# EAGLE design rgbled (EAGLE 6.5.0)
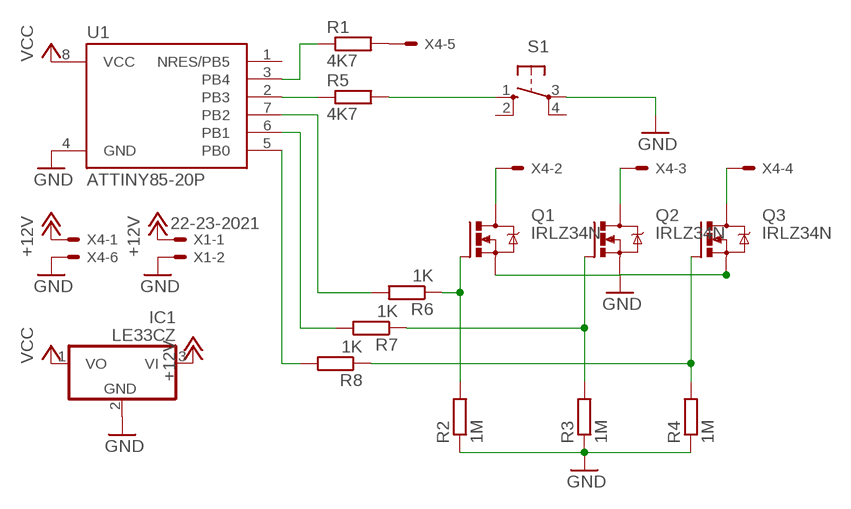
[diagram p0: schematic, sheet 1]

## Parts
IC1  LE33CZ  78L05Z  [TO92]
Q1  IRLZ34N  IRF540  [TO220BV]
Q2  IRLZ34N  IRF540  [TO220BV]
Q3  IRLZ34N  IRF540  [TO220BV]
R1  4K7  R-EU_0204/5  [0204/5]
R2  1M  R-EU_0204/5  [0204/5]
R3  1M  R-EU_0204/5  [0204/5]
R4  1M  R-EU_0204/5  [0204/5]
R5  4K7  R-EU_0204/5  [0204/5]
R6  1K  R-EU_0204/5  [0204/5]
R7  1K  R-EU_0204/5  [0204/5]
R8  1K  R-EU_0204/5  [0204/5]
S1  10-XX  [B3F-10XX]
U1  ATTINY85-20P  [PDIP08_300MIL]
X1  22-23-2021  [22-23-2021]
X4  22-23-2061  [22-23-2061]

## Nets
+12V: IC1.3(VI) X1.1 X4.1
GND: IC1.2(GND) Q1.S Q2.S Q3.S R2.1 R3.1 R4.1 S1.3(P) U1.4(GND) X1.2 X4.6
N$1: R5.2 S1.1(S)
N$2: Q1.D X4.2
N$3: Q2.D X4.3
N$4: Q3.D X4.4
N$5: R1.1 U1.3(PB4)
N$6: Q1.G R2.2 R6.1
N$8: Q2.G R3.2 R7.1
N$9: Q3.G R4.2 R8.1
N$10: R8.2 U1.5(PB0)
N$11: R7.2 U1.6(PB1)
N$12: R6.2 U1.7(PB2)
N$13: R1.2 X4.5
N$14: R5.1 U1.2(PB3)
VCC: IC1.1(VO) U1.8(VCC)
Unconnected: S1.2(S1) S1.4(P1) U1.1(NRES/PB5)

## Library data of the parts
IC1 = linear:78*: Positive VOLTAGE REGULATOR Source: http://cache.national.com/ds/LM/LM78L05.pdf http://www.fairchildsemi.com/ds/LM/LM7805.pdf
Q1-Q3 = transistor-power:IRF540: HEXFET Power MOSFET
R1-R8 = resistor:R-EU_: RESISTOR, European symbol
S1 = switch-omron:10-XX: OMRON SWITCH; MPN: B3F-1000; OC_FARNELL: 176432; OC_NEWARK: 36M3542
U1 = _hhn_attiny25_45_85:ATTINY85*: ATMEL ATtiny 85 Packages: P = PDIP 08 30mil S = SOIC 08 EIAJ 208mil Technologies Note: for complete ordering code (temp. range, finish, tape&reel etc.) see www.atmel.com • Supply Voltage: V = (1.8…5.5)V | [blank] = (2.7…5.5)V • Speed: 10 = 10 MHz | 20 = 20 MHz Author: Dipl.-Ing. FH Rainer Bayer HHN Hochschule Heilbronn (Heilbronn University), rainer.bayer@hs-heilbronn.de Ingenieurbüro ing-rb, mail@ing-rb.de
X1 = con-molex:22-23-2021: .100" (2.54mm) Center Header - 2 Pin; MF: MOLEX; MPN: 22-23-2021; OC_FARNELL: 1462926; OC_NEWARK: 25C3832
X4 = con-molex:22-23-2061: .100" (2.54mm) Center Header - 6 Pin; MF: MOLEX; MPN: 22-23-2061; OC_FARNELL: 1462922; OC_NEWARK: 27C1933

## Board
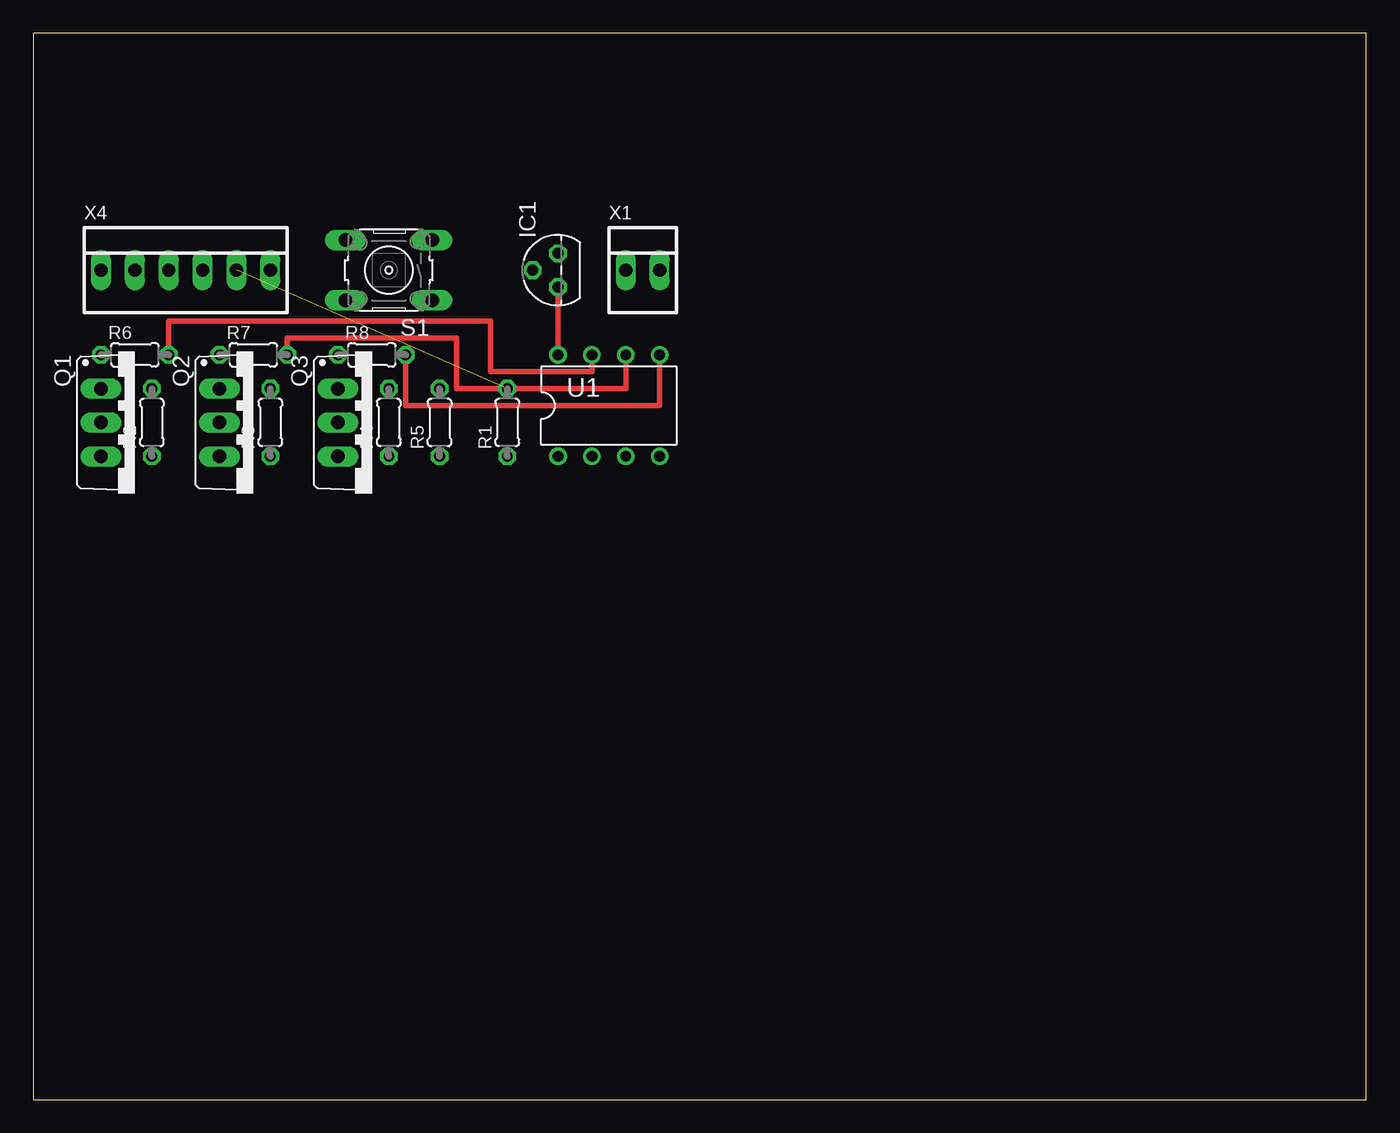
[diagram p1: board, top side]
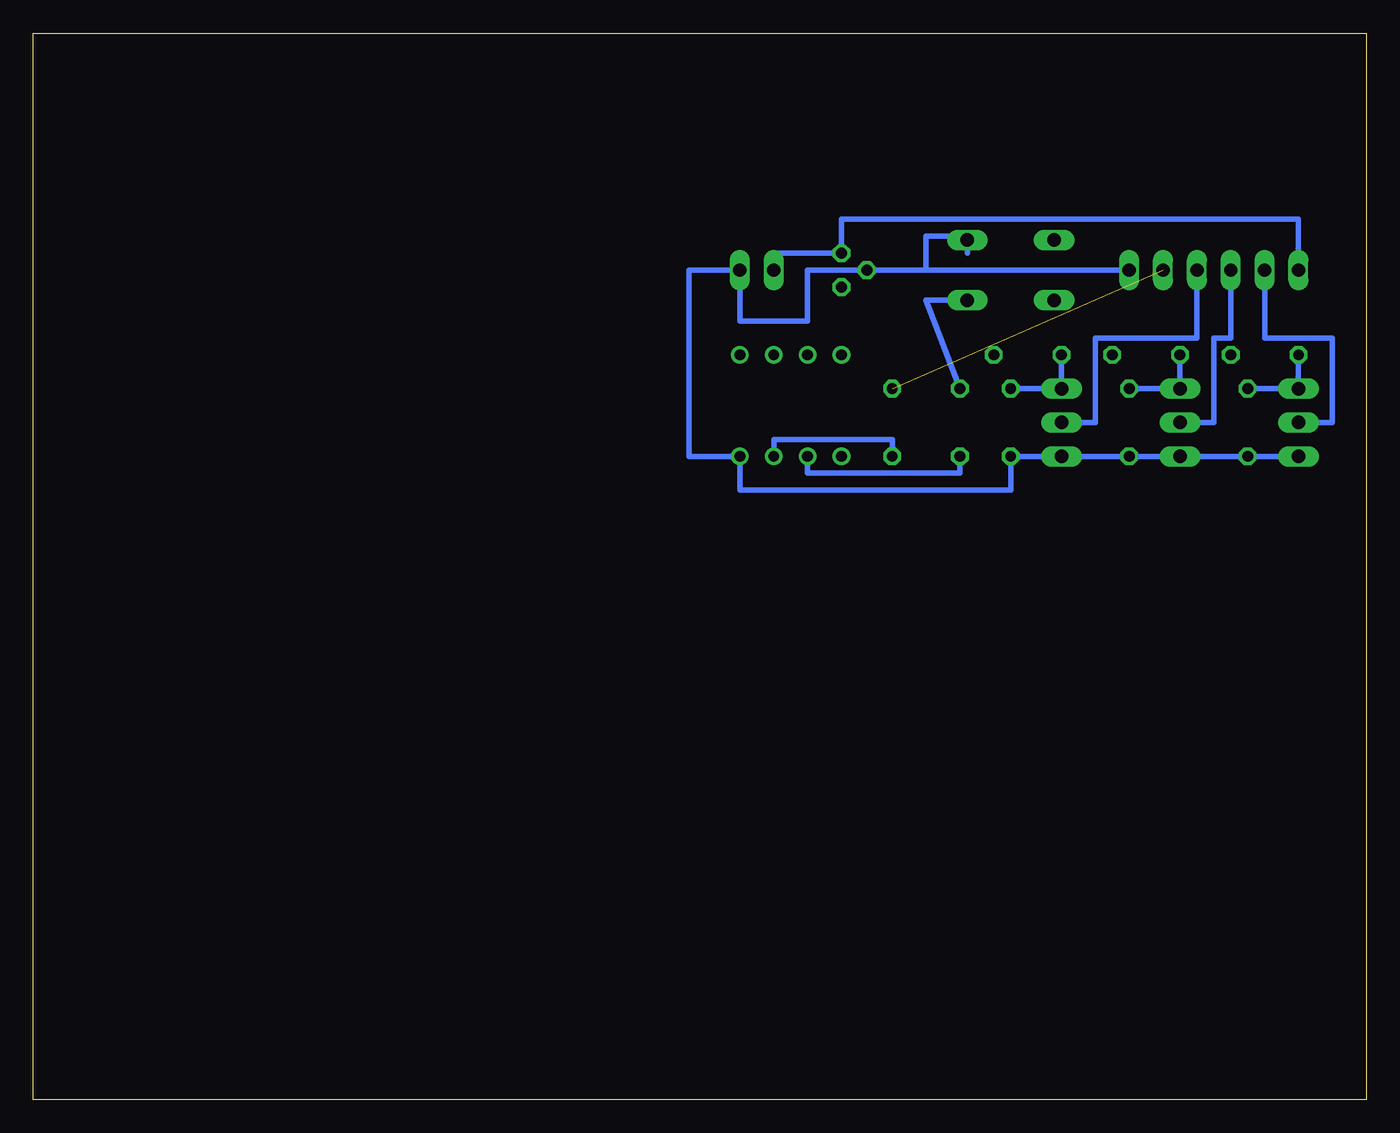
[diagram p2: board, bottom side, seen from below]

Size 100 x 80 mm. Coordinates in mm from the lower left corner, seen from the top.
Outline: 0,0 100,0 100,80 0,80 0,0
Copper layers (1*16): Top 0.035mm / dielectric 1.5mm / Bottom 0.035mm
Design rules "default": minimum track width 10mil, minimum drill 24mil, track to track 8mil, track to pad 8mil, pad to pad 8mil, via to via 8mil, smd to smd 8mil, copper to edge 40mil, drill to drill 8mil, minimum pad ring 10mil, minimum via ring 8mil, stop-mask expansion 4mil, vias tented up to drill 0mil, thermal gap 10mil

### Footprints (pad centres in the part's own frame; a part is rotated, then mirrored left to right if it is on the bottom)
TO92 = drill 0.813 octagon: 1 -1.27,0; 2 0,1.905; 3 1.27,0
TO220BV = drill 1.016 long: D 0,-2.54; G -2.54,-2.54; S 2.54,-2.54
0204/5 = drill 0.813 octagon: 1 -2.54,0; 2 2.54,0
B3F-10XX = drill 1.016 long: 1 -3.251,2.261; 2 3.251,2.261; 3 -3.251,-2.261; 4 3.251,-2.261
PDIP08_300MIL = drill 0.813: 1 -3.81,-3.81; 2 -1.27,-3.81; 3 1.27,-3.81; 4 3.81,-3.81; 5 3.81,3.81; 6 1.27,3.81; 7 -1.27,3.81; 8 -3.81,3.81
22-23-2021 = drill 1 long: 1 -1.27,0; 2 1.27,0
22-23-2061 = drill 1 long: 1 -6.35,0; 2 -3.81,0; 3 -1.27,0; 4 1.27,0; 5 3.81,0; 6 6.35,0

### Placement (x,y rotation side)
IC1  39.37,62.23 90 top
Q1  7.62,50.8 270 top
Q2  16.51,50.8 270 top
Q3  25.4,50.8 270 top
R1  35.56,50.8 90 top
R2  8.89,50.8 90 top
R3  17.78,50.8 90 top
R4  26.67,50.8 90 top
R5  30.48,50.8 90 top
R6  7.62,55.88 0 top
R7  16.51,55.88 0 top
R8  25.4,55.88 0 top
S1  26.67,62.23 180 top
U1  43.18,52.07 0 top
X1  45.72,62.23 0 top
X4  11.43,62.23 0 top

### Tracks (layer width: path | path; a pad name or v marks a point on that pad's centre or on a via)
+12V
  Bottom 0.406: X4.1 5.08,66.04 39.37,66.04 IC1.3 44.45,63.5 X1.1
GND
  Bottom 0.406: Q1.S R2.1 Q2.S R3.1 Q3.S R4.1 26.67,45.72 46.99,45.72 U1.4 50.8,48.26 50.8,62.23 X1.2 46.99,58.42 41.91,58.42 41.91,62.23 IC1.2 X4.6 33.02,62.23 33.02,64.77 29.92,64.77 S1.3 29.92,63.5
N$1
  Bottom 0.406: S1.1 33.02,59.97 R5.2
N$2
  Bottom 0.406: Q1.D 2.54,50.8 2.54,57.15 7.62,57.15 X4.2
N$3
  Bottom 0.406: Q2.D 11.43,50.8 11.43,57.15 10.16,57.15 X4.3
N$4
  Bottom 0.406: Q3.D 20.32,50.8 20.32,57.15 12.7,57.15 X4.4
N$5
  Bottom 0.406: U1.3 44.45,49.53 35.56,49.53 R1.1
N$6
  Bottom 0.406: R6.1 Q1.G R2.2
N$8
  Bottom 0.406: R3.2 Q2.G R7.1
N$9
  Bottom 0.406: R4.2 Q3.G R8.1
N$10
  Top 0.406: U1.5 46.99,52.07 27.94,52.07 R8.2
N$11
  Top 0.406: U1.6 44.45,53.34 31.75,53.34 31.75,57.15 19.05,57.15 R7.2
N$12
  Top 0.406: U1.7 41.91,54.61 34.29,54.61 34.29,58.42 10.16,58.42 R6.2
N$13  (1 unrouted)
N$14
  Bottom 0.406: R5.1 30.48,46.99 41.91,46.99 U1.2
VCC
  Top 0.406: IC1.1 U1.8